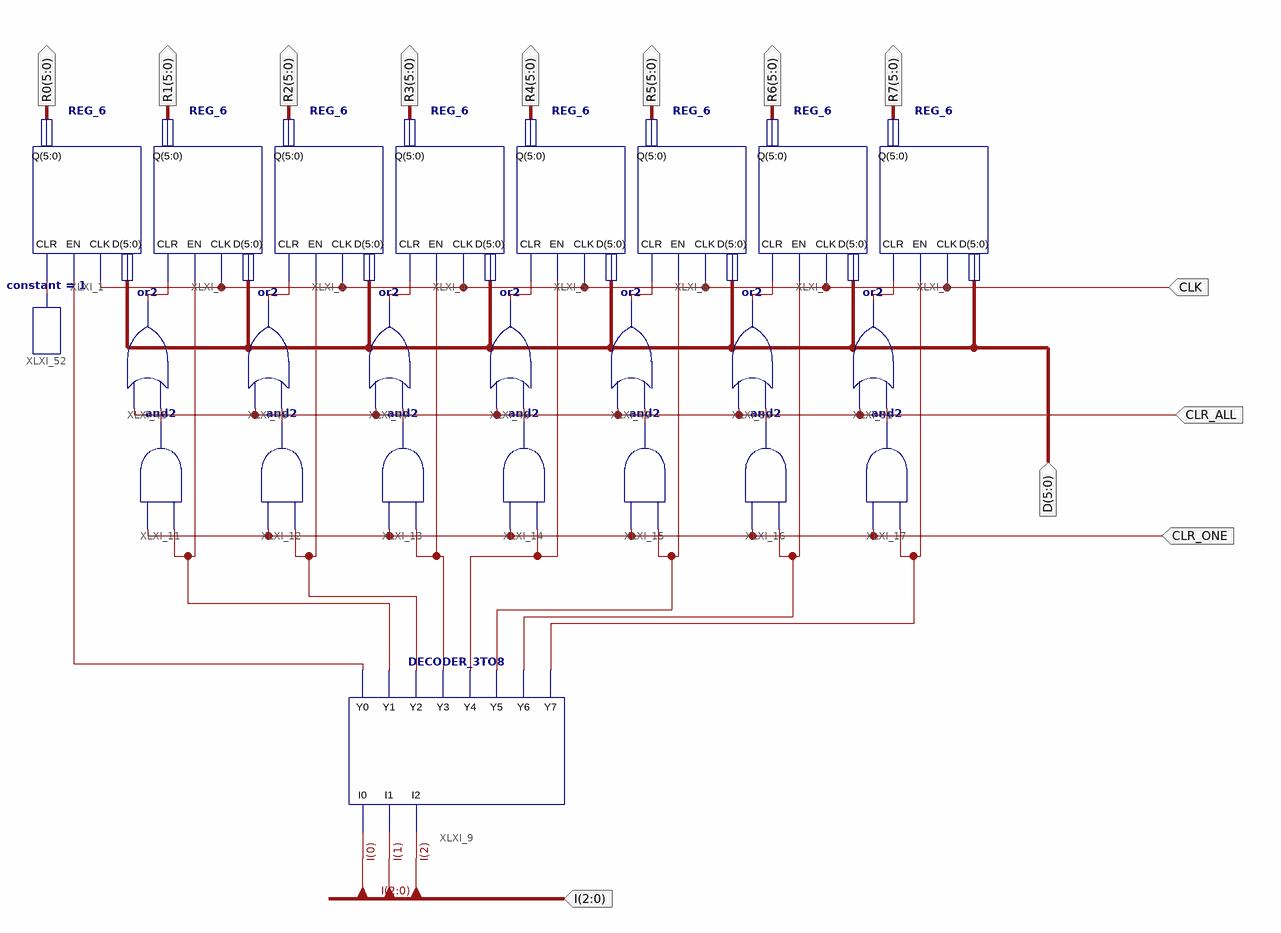
[diagram p0: schematic sheet 1]
// Xilinx ISE schematic REG_BANK_8_6.sch (spartan3e) as structural Verilog: 24 symbols, 13 ports
module REG_BANK_8_6 (
  input  CLR_ONE,
  input  [2:0] I,
  input  [5:0] D,
  input  CLK,
  input  CLR_ALL,
  output [5:0] R1,
  output [5:0] R2,
  output [5:0] R3,
  output [5:0] R4,
  output [5:0] R5,
  output [5:0] R6,
  output [5:0] R7,
  output [5:0] R0
);

  wire XLXN_9, XLXN_10, XLXN_11, XLXN_12, XLXN_13, XLXN_14, XLXN_15, XLXN_16, XLXN_101, XLXN_102, XLXN_103,
       XLXN_104, XLXN_105, XLXN_106, XLXN_107, XLXN_108, XLXN_109, XLXN_110, XLXN_111, XLXN_112, XLXN_113,
       XLXN_114, XLXN_117;

  DECODER_3TO8 XLXI_9 (
    .I0(I[0]), .I1(I[1]), .I2(I[2]), .Y0(XLXN_9), .Y1(XLXN_10), .Y2(XLXN_11), .Y3(XLXN_12), .Y4(XLXN_13),
    .Y5(XLXN_14), .Y6(XLXN_15), .Y7(XLXN_16));
  and XLXI_11 (XLXN_101, XLXN_10, CLR_ONE);
  and XLXI_12 (XLXN_102, XLXN_11, CLR_ONE);
  and XLXI_13 (XLXN_103, XLXN_12, CLR_ONE);
  and XLXI_14 (XLXN_104, XLXN_13, CLR_ONE);
  and XLXI_15 (XLXN_105, XLXN_14, CLR_ONE);
  and XLXI_16 (XLXN_106, XLXN_15, CLR_ONE);
  and XLXI_17 (XLXN_107, XLXN_16, CLR_ONE);
  REG_6 XLXI_2 (.CLK(CLK), .CLR(XLXN_108), .D(D), .EN(XLXN_10), .Q(R1));
  REG_6 XLXI_3 (.CLK(CLK), .CLR(XLXN_109), .D(D), .EN(XLXN_11), .Q(R2));
  REG_6 XLXI_4 (.CLK(CLK), .CLR(XLXN_110), .D(D), .EN(XLXN_12), .Q(R3));
  REG_6 XLXI_5 (.CLK(CLK), .CLR(XLXN_111), .D(D), .EN(XLXN_13), .Q(R4));
  REG_6 XLXI_6 (.CLK(CLK), .CLR(XLXN_112), .D(D), .EN(XLXN_14), .Q(R5));
  REG_6 XLXI_7 (.CLK(CLK), .CLR(XLXN_113), .D(D), .EN(XLXN_15), .Q(R6));
  REG_6 XLXI_8 (.CLK(CLK), .CLR(XLXN_114), .D(D), .EN(XLXN_16), .Q(R7));
  REG_6 XLXI_1 (.CLK(CLK), .CLR(XLXN_117), .D(D), .EN(XLXN_9), .Q(R0));
  or XLXI_45 (XLXN_108, XLXN_101, CLR_ALL);
  or XLXI_46 (XLXN_109, XLXN_102, CLR_ALL);
  or XLXI_47 (XLXN_110, XLXN_103, CLR_ALL);
  or XLXI_48 (XLXN_111, XLXN_104, CLR_ALL);
  or XLXI_49 (XLXN_112, XLXN_105, CLR_ALL);
  or XLXI_50 (XLXN_113, XLXN_106, CLR_ALL);
  or XLXI_51 (XLXN_114, XLXN_107, CLR_ALL);
  constant #(.CValue("1")) XLXI_52 (.O(XLXN_117));
endmodule
